# Altium schematic sheet BLDC_MOTOR_TC264.SCHDOC
size A2
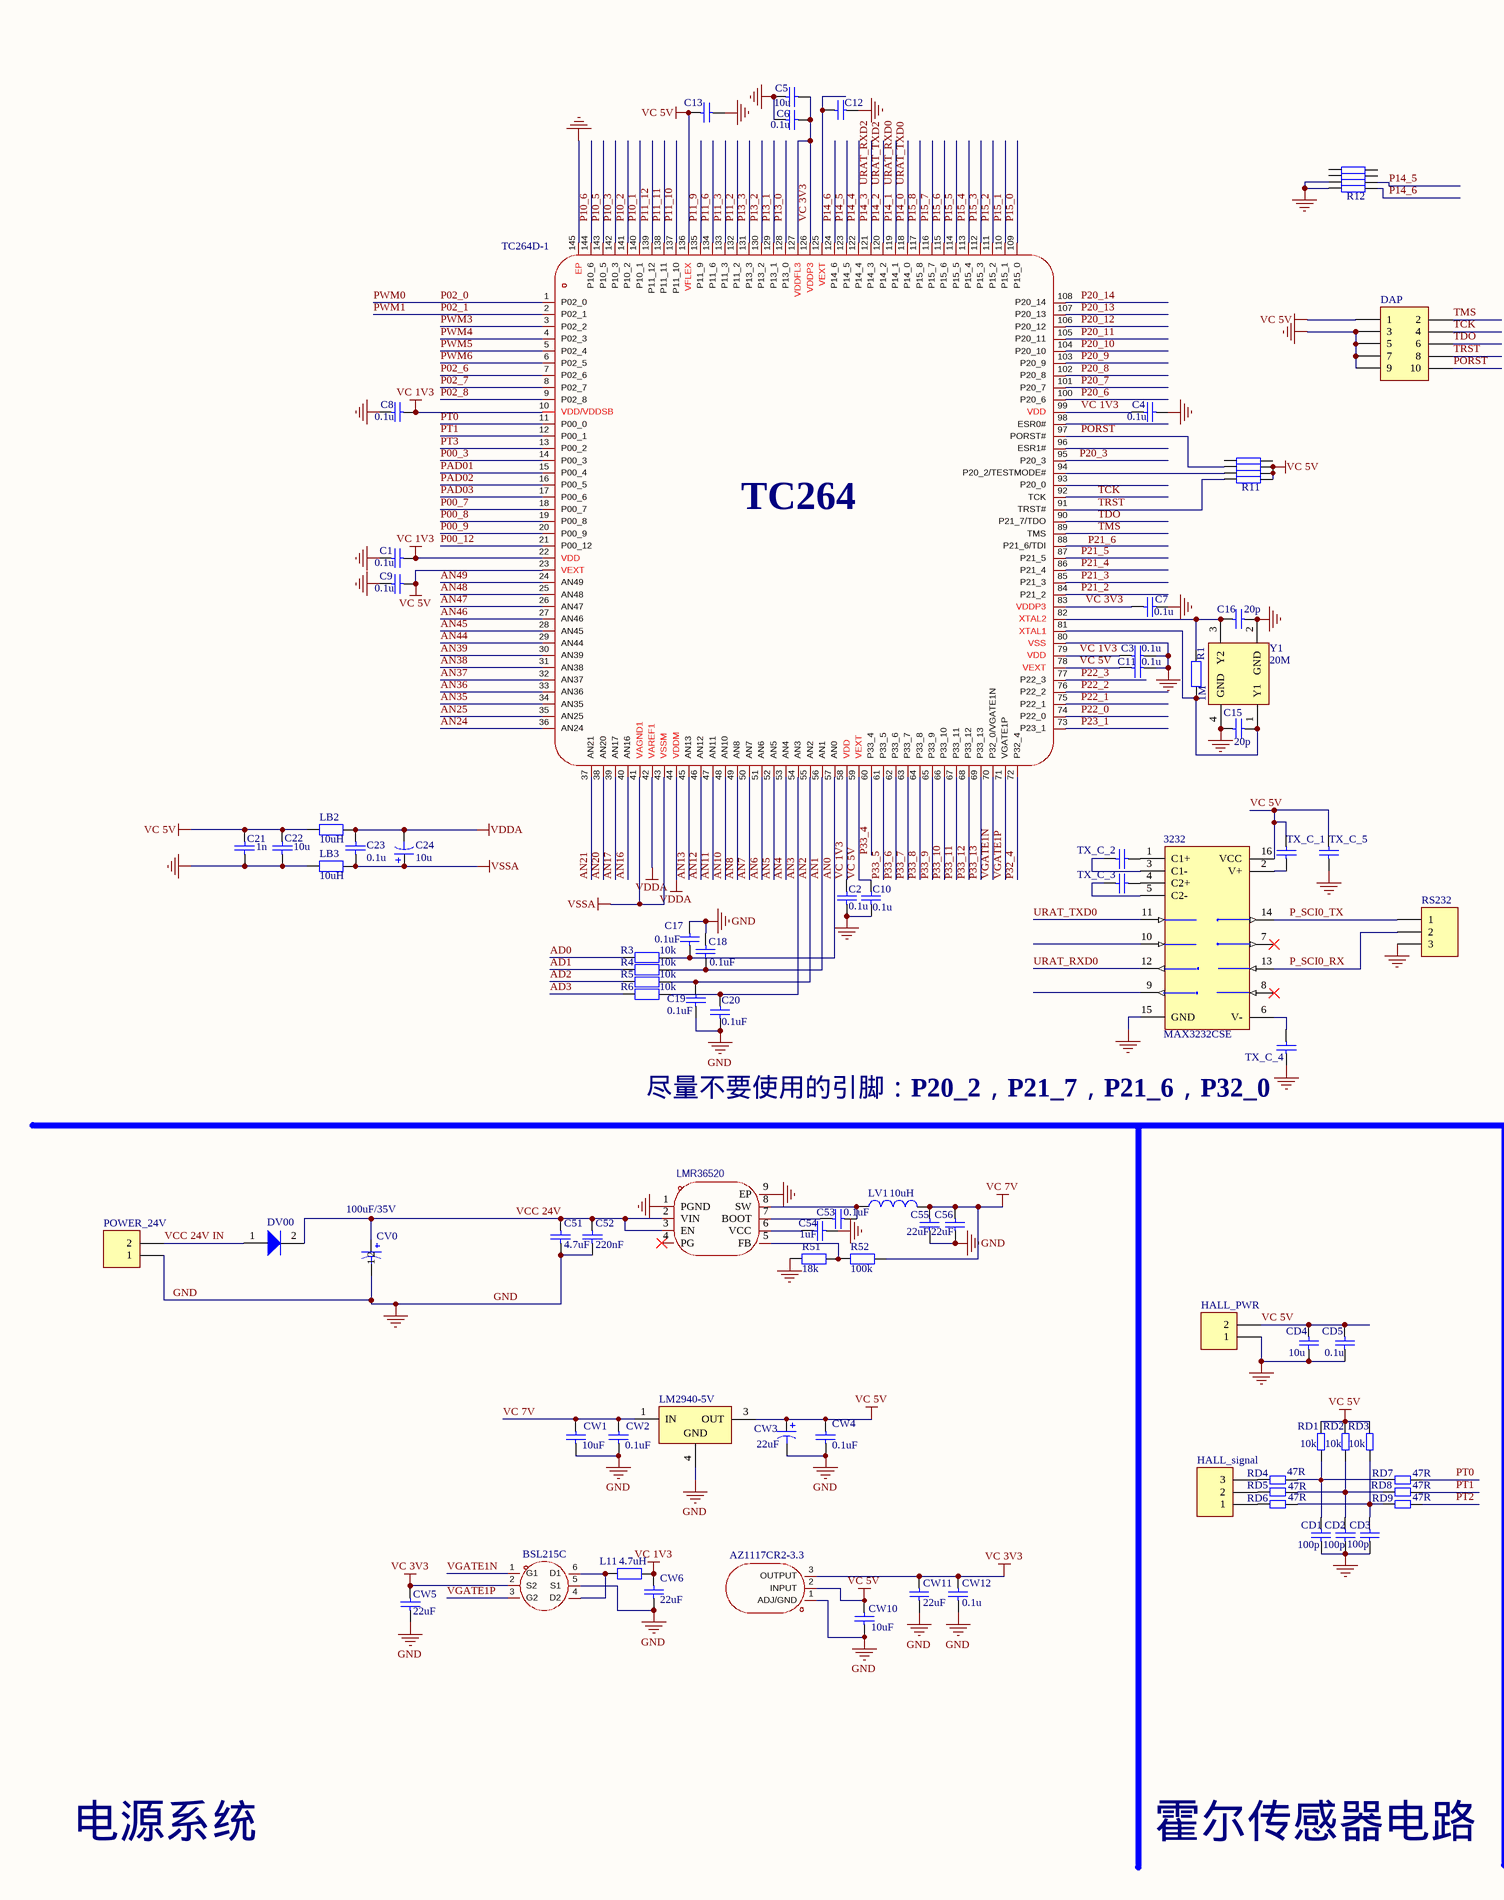
[diagram p0: BLDC_MOTOR_TC264.SCHDOC, left]
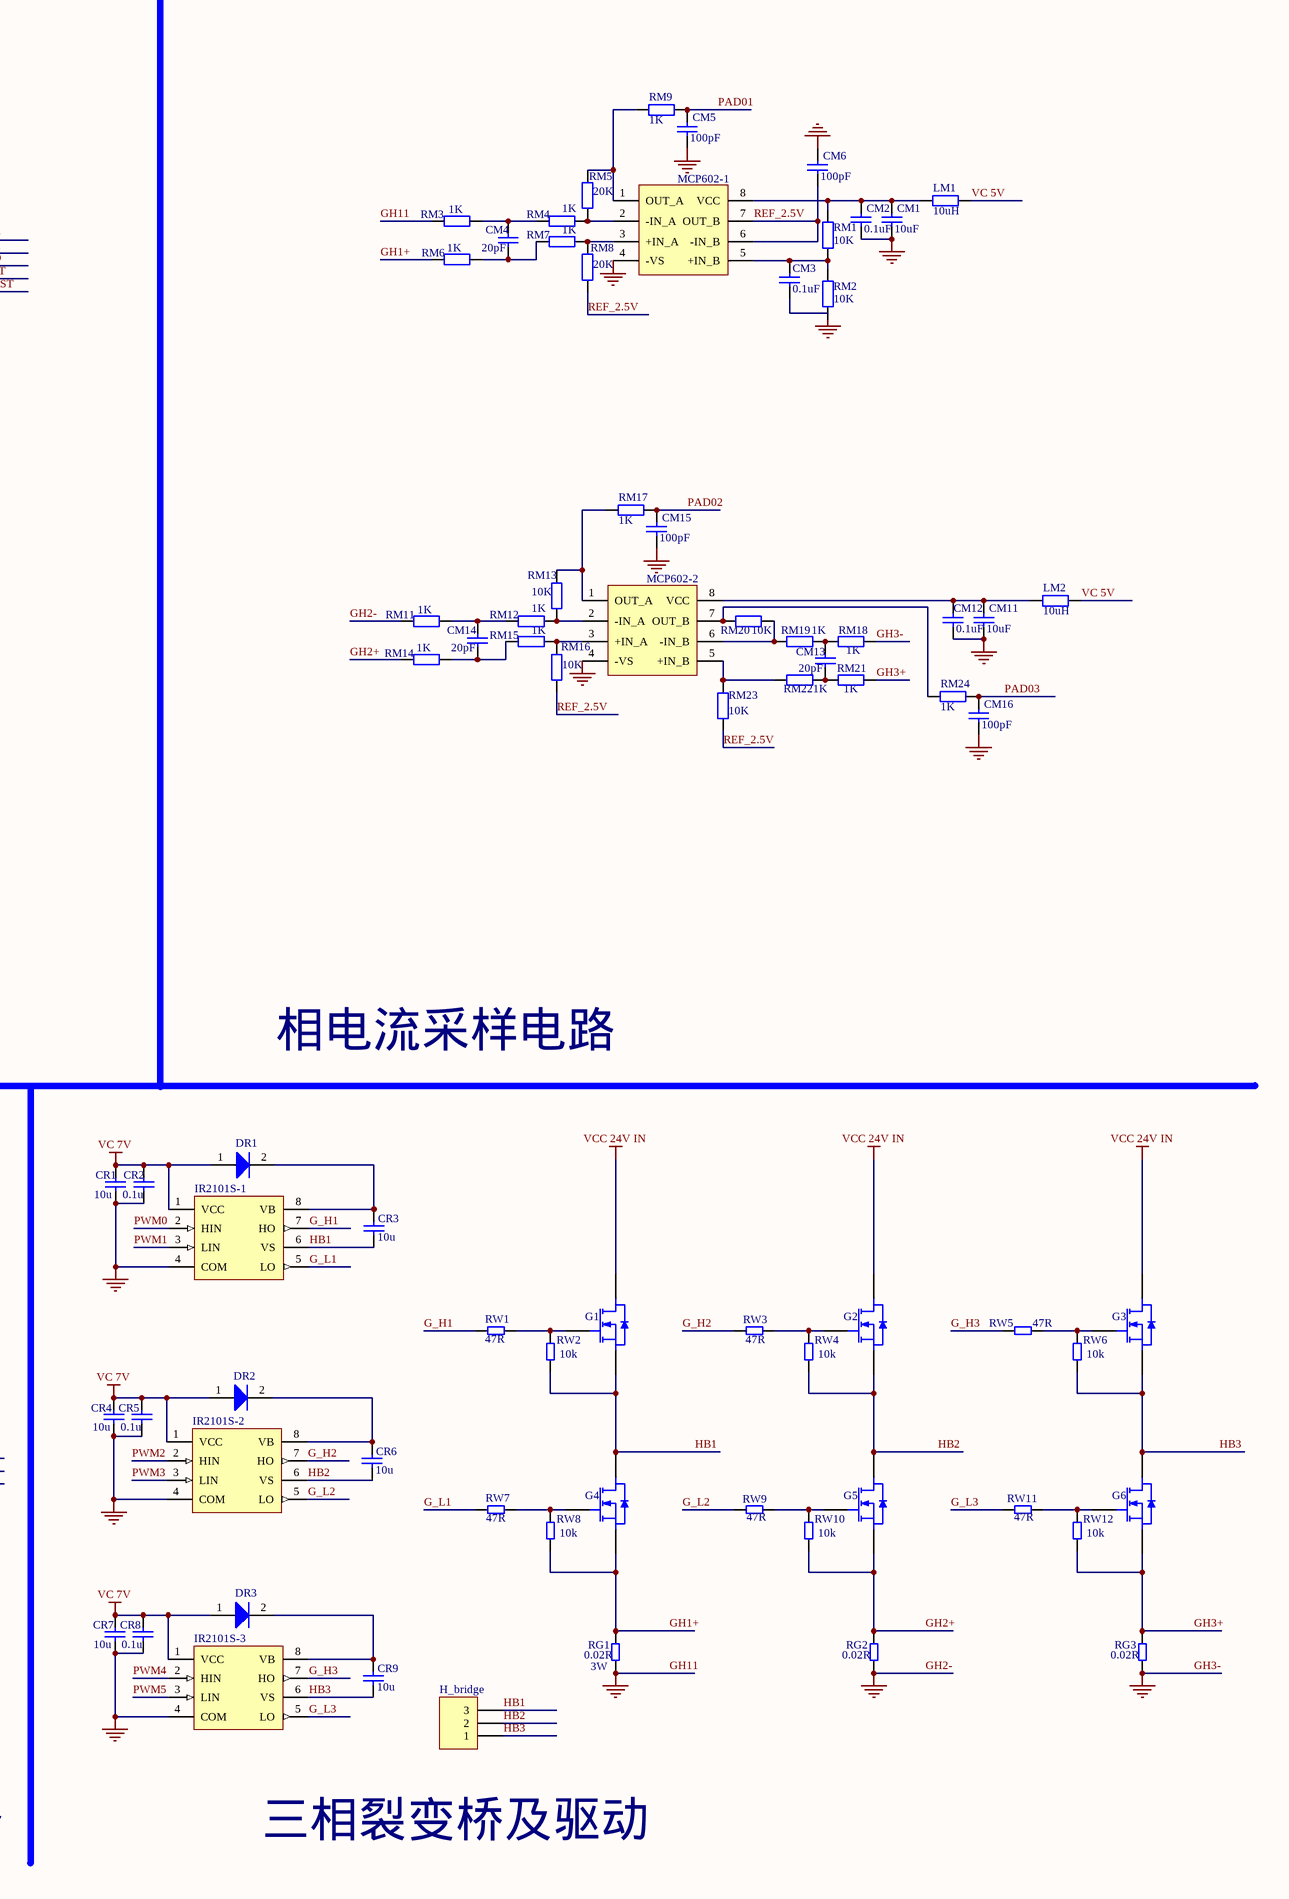
[diagram p1: BLDC_MOTOR_TC264.SCHDOC, right]

## Parts
3232  MAX3232CSE  [LC-TSSOP-16]
AZ1117CR2-3.3  AZ1117CR2-3.3  [LC-SOT-89(SOT-89-3)]
BSL215C  BSL215C  [LC-SOT-23-6]
C1  0.1u  [LC-0603_C]
C2  0.1u  [LC-0603_C]
C3  0.1u  [LC-0603_C]
C4  0.1u  [LC-0603_C]
C5  10u  [LC-0603_C]
C6  0.1u  [LC-0603_C]
C7  0.1u  [LC-0603_C]
C8  0.1u  [LC-0603_C]
C9  0.1u  [LC-0603_C]
C10  0.1u  [LC-0603_C]
C11  0.1u  [LC-0603_C]
C12  0.1u  [LC-0603_C]  (value not drawn)
C13  0.1u  [LC-0603_C]  (value not drawn)
C15  20p  [LC-0603_C]
C16  20p  [LC-0603_C]
C17  0.1uF  [LC-0603_C]
C18  0.1uF  [LC-0603_C]
C19  0.1uF  [LC-0603_C]
C20  0.1uF  [LC-0603_C]
C21  1n  [LC-0603_C]
C22  10u  [LC-0603_C]
C23  0.1u  [LC-0603_C]
C24  10u  [LC-0603_C]
C51  4.7uF  [LC-0805_C]
C52  220nF  [LC-0805_C]
C53  0.1uF  [LC-0603_C]
C54  1uF  [LC-0603_C]
C55  22uF  [LC-0805_C]
C56  22uF  [LC-0805_C]
CD1  100p  [LC-0805_C]
CD2  100p  [LC-0805_C]
CD3  100p  [LC-0805_C]
CD4  10u  [LC-0805_C]
CD5  0.1u  [LC-0805_C]
CM1  value 10uF  [LC-0805_C]  (hidden comment: 10u)
CM2  value 0.1uF  [LC-0805_C]  (hidden comment: Cap)
CM3  value 0.1uF  [0805]  (hidden comment: Cap)
CM4  value 20pF  [LC-0805_C]  (hidden comment: Cap)
CM5  value 100pF  [LC-0805_C]  (hidden comment: Cap)
CM6  value 100pF  [LC-0805_C]  (hidden comment: Cap)
CM11  value 10uF  [LC-0805_C]  (hidden comment: 10u)
CM12  value 0.1uF  [LC-0805_C]  (hidden comment: Cap)
CM13  value 20pF  [LC-0805_C]  (hidden comment: Cap)
CM14  value 20pF  [LC-0805_C]  (hidden comment: Cap)
CM15  value 100pF  [LC-0805_C]  (hidden comment: Cap)
CM16  100pF  [LC-0805_C]
CR1  10u  [LC-0805_C]
CR2  0.1u  [LC-0805_C]
CR3  10u  [LC-1206_C]
CR4  10u  [LC-0805_C]
CR5  0.1u  [LC-0805_C]
CR6  10u  [LC-1206_C]
CR7  10u  [LC-0805_C]
CR8  0.1u  [LC-0805_C]
CR9  10u  [LC-1206_C]
CV0  value 100uF/35V  [CAP_SMD_8*10.2]  (hidden comment: Cap Pol1)
CW1  10uF  [LC-0603_C]
CW2  value 0.1uF  [LC-0603_C]  (hidden comment: 0.1u)
CW3  22uF  [LC-0805_C]
CW4  value 0.1uF  [LC-0603_C]  (hidden comment: 0.1u)
CW5  22uF  [LC-0603_C]
CW6  22uF  [LC-0603_C]
CW10  10uF  [LC-0603_C]
CW11  22uF  [LC-0603_C]
CW12  0.1u  [LC-0603_C]
DAP  Header 5X2  [HDR2X5]  (value not drawn)
DR1  C84635  [LC-SMA(DO-214AC)_S2]  (value not drawn)
DR2  C84635  [LC-SMA(DO-214AC)_S2]  (value not drawn)
DR3  C84635  [LC-SMA(DO-214AC)_S2]  (value not drawn)
DV00  C35722  [LC-SMA(DO-214AC)_S5]  (value not drawn)
G1  BUK9222  [TO-252-2]  (value not drawn)
G2  BUK9222  [TO-252-2]  (value not drawn)
G3  BUK9222  [TO-252-2]  (value not drawn)
G4  BUK9222  [TO-252-2]  (value not drawn)
G5  BUK9222  [TO-252-2]  (value not drawn)
G6  BUK9222  [TO-252-2]  (value not drawn)
H_bridge  Header 3  [kf128_duanzi_3P]  (value not drawn)
HALL_PWR  (no value)  [KF128-jiexian_2P]
HALL_signal  Header 3  [kf128_duanzi_3P]  (value not drawn)
IR2101S-1  IR2101  [LC-SOIC-8_150mil]  (value not drawn)
IR2101S-2  IR2101  [LC-SOIC-8_150mil]  (value not drawn)
IR2101S-3  IR2101  [LC-SOIC-8_150mil]  (value not drawn)
L11  4.7uH  [L0806]
LB2  value 10uH  [LC-1206_L]  (hidden comment: C1051)
LB3  value 10uH  [LC-1206_L]  (hidden comment: C1051)
LM1  10uH  [LC-0805_L]
LM2  10uH  [LC-0805_L]
LM2940-5V  LM2940  [LC-SOT-223]  (value not drawn)
LMR36520  LMR36520FADDAR  [LC-SOIC-8_EP_150mil]  (value not drawn)
LV1  value 10uH  [SMD_0650]  (hidden comment: Inductor)
MCP602-1  LM258  [SOP8_555_lm393]  (value not drawn)
MCP602-2  LM258  [SOP8_555_lm393]  (value not drawn)
POWER_24V  Header 2  [KF128-jiexian_2P]  (value not drawn)
R1  1M  [LC-0603_R]
R3  10k  [LC-0603_R]
R4  10k  [LC-0603_R]
R5  10k  [LC-0603_R]
R6  10k  [LC-0603_R]
R11  10k  [LC-0603_Rx4]  (value not drawn)
R12  47k  [LC-0603_Rx4]  (value not drawn)
R51  18k  [LC-0603_R]
R52  100k  [LC-0603_R]
RD1  10k  [LC-0805_R]
RD2  10k  [LC-0805_R]
RD3  10k  [LC-0805_R]
RD4  47R  [LC-0805_R]
RD5  47R  [LC-0805_R]
RD6  47R  [LC-0805_R]
RD7  47R  [LC-0805_R]
RD8  47R  [LC-0805_R]
RD9  47R  [LC-0805_R]
RG1  0.02R  [LC-2512_R]
RG2  0.02R  [LC-2512_R]
RG3  0.02R  [LC-2512_R]
RM1  value 10K  [LC-0805_R]  (hidden comment: Res2)
RM2  value 10K  [LC-0805_R]  (hidden comment: Res2)
RM3  value 1K  [LC-0805_R]  (hidden comment: Res2)
RM4  value 1K  [LC-0805_R]  (hidden comment: Res2)
RM5  value 20K  [LC-0805_R]  (hidden comment: Res2)
RM6  value 1K  [LC-0805_R]  (hidden comment: Res2)
RM7  value 1K  [LC-0805_R]  (hidden comment: Res2)
RM8  value 20K  [LC-0805_R]  (hidden comment: Res2)
RM9  value 1K  [LC-0805_R]  (hidden comment: Res2)
RM11  value 1K  [LC-0805_R]  (hidden comment: Res2)
RM12  value 1K  [LC-0805_R]  (hidden comment: Res2)
RM13  value 10K  [LC-0805_R]  (hidden comment: Res2)
RM14  value 1K  [LC-0805_R]  (hidden comment: Res2)
RM15  value 1K  [LC-0805_R]  (hidden comment: Res2)
RM16  value 10K  [LC-0805_R]  (hidden comment: Res2)
RM17  value 1K  [LC-0805_R]  (hidden comment: Res2)
RM18  value 1K  [LC-0805_R]  (hidden comment: Res2)
RM19  value 1K  [LC-0805_R]  (hidden comment: Res2)
RM20  value 10K  [LC-0805_R]  (hidden comment: Res2)
RM21  value 1K  [LC-0805_R]  (hidden comment: Res2)
RM22  value 1K  [LC-0805_R]  (hidden comment: Res2)
RM23  value 10K  [LC-0805_R]  (hidden comment: Res2)
RM24  value 1K  [LC-0805_R]  (hidden comment: Res2)
RS232  Header 3  [kf128_duanzi_3P]  (value not drawn)
RW1  47R  [0805]
RW2  10k  [0805]
RW3  47R  [0805]
RW4  10k  [0805]
RW5  47R  [0805]
RW6  10k  [0805]
RW7  47R  [0805]
RW8  10k  [0805]
RW9  47R  [0805]
RW10  10k  [0805]
RW11  47R  [0805]
RW12  10k  [0805]
TC264D-1  TC264D  [TC264D-LQFP144]  (value not drawn)
TX_C_1  0.1u  [LC-0603_C]  (value not drawn)
TX_C_2  0.1u  [LC-0603_C]  (value not drawn)
TX_C_3  0.1u  [LC-0603_C]  (value not drawn)
TX_C_4  0.1u  [LC-0603_C]  (value not drawn)
TX_C_5  0.1u  [LC-0603_C]  (value not drawn)
Y1  20M  [LC-SMD-3225_4P]

## Nets
GH11: 3232.15(GND) AZ1117CR2-3.3.1(ADJ/GND) BSL215C.5(S1) C1.2 C2.1 C3.1 C4.1 C5.1 C6.2 C7.2 C8.2 C9.2 C10.2 C11.1 C12.1 C13.2 C15.1 C16.1 C17.2 C18.2 C19.1 C20.1 C21.2 C22.2 C51.1 C52.1 C54.1 C55.2 C56.2 CD1.2 CD2.2 CD3.2 CD4.2 CD5.2 CM1.1 CM2.1 CM3.1 CM5.1 CM6.2 CM11.1 CM12.1 CM15.1 CM16.1 CR1.2 CR2.2 CR4.2 CR5.2 CR7.2 CR8.2 CV0.2 CW1.1 CW2.1 CW3.2 CW4.1 CW5.1 CW6.1 CW10.1 CW11.1 CW12.1 DAP.3 DAP.5 DAP.7 DAP.9 HALL_PWR.1 IR2101S-1.4(COM) IR2101S-2.4(COM) IR2101S-3.4(COM) LB3.2 LM2940-5V.4(GND) LMR36520.1(PGND) LMR36520.9(EP) MCP602-1.4(-VS) MCP602-2.4(-VS) POWER_24V.1 R12.3 R12.4 R51.2 RG1.2 RG2.2 RG3.2 RM3.2 RM11.2 RM18.2 RS232.3 TC264D-1.80(VSS) TC264D-1.145(EP) TX_C_4.1 TX_C_5.1 Y1.2(GND) Y1.4(GND)  [also labelled GH2-, GH3-, GND]
VC 1V3: C1.1 C2.2 C3.2 C4.2 C8.1 CW6.2 L11.2 TC264D-1.10(VDD/VDDSB) TC264D-1.22(VDD) TC264D-1.58(VDD) TC264D-1.79(VDD) TC264D-1.99(VDD)
VC 3V3: AZ1117CR2-3.3.3(OUTPUT) BSL215C.2(S2) C5.2 C6.1 C7.1 CW5.2 CW11.2 CW12.2 TC264D-1.83(VDDP3) TC264D-1.126(VDDP3) TC264D-1.127(VDDFL3)
VC 5V: 3232.16(VCC) AZ1117CR2-3.3.2(INPUT) C9.1 C10.1 C11.2 C13.1 C21.1 C22.1 CD4.1 CD5.1 CW3.1 CW4.2 CW10.2 DAP.1 HALL_PWR.2 LB2.2 LM1.1 LM2.1 LM2940-5V.3(OUT) R11.5 R11.6 R11.7 RD1.1 RD2.1 RD3.1 TC264D-1.23(VEXT) TC264D-1.59(VEXT) TC264D-1.78(VEXT) TC264D-1.136(VFLEX) TX_C_1.2 TX_C_5.2
VC 7V: C55.1 C56.1 CR1.1 CR2.1 CR4.1 CR5.1 CR7.1 CR8.1 CW1.2 CW2.2 DR1.1(A) DR2.1(A) DR3.1(A) IR2101S-1.1(VCC) IR2101S-2.1(VCC) IR2101S-3.1(VCC) LM2940-5V.1(IN) LV1.2 R52.1
VCC 24V IN: DV00.1(A) G1.2(D) G2.2(D) G3.2(D) POWER_24V.2
VDDA: C23.1 C24.2 LB2.1 TC264D-1.42(VAREF1) TC264D-1.44(VDDM)
VSSA: C23.2 C24.1 LB3.1 TC264D-1.41(VAGND1) TC264D-1.43(VSSM)
AD0: R3.1
AD1: R4.1
AD2: R5.1
AD3: R6.1
AN0: C17.1 R3.2 TC264D-1.57(AN0)
AN1: C18.1 R4.2 TC264D-1.56(AN1)
AN2: C19.2 R5.2 TC264D-1.55(AN2)
AN3: C20.2 R6.2 TC264D-1.54(AN3)
AN4: TC264D-1.53(AN4)
AN5: TC264D-1.52(AN5)
AN6: TC264D-1.51(AN6)
AN7: TC264D-1.50(AN7)
AN8: TC264D-1.49(AN8)
AN10: TC264D-1.48(AN10)
AN11: TC264D-1.47(AN11)
AN12: TC264D-1.46(AN12)
AN13: TC264D-1.45(AN13)
AN16: TC264D-1.40(AN16)
AN17: TC264D-1.39(AN17)
AN20: TC264D-1.38(AN20)
AN21: TC264D-1.37(AN21)
AN24: TC264D-1.36(AN24)
AN25: TC264D-1.35(AN25)
AN35: TC264D-1.34(AN35)
AN36: TC264D-1.33(AN36)
AN37: TC264D-1.32(AN37)
AN38: TC264D-1.31(AN38)
AN39: TC264D-1.30(AN39)
AN44: TC264D-1.29(AN44)
AN45: TC264D-1.28(AN45)
AN46: TC264D-1.27(AN46)
AN47: TC264D-1.26(AN47)
AN48: TC264D-1.25(AN48)
AN49: TC264D-1.24(AN49)
G_H1: IR2101S-1.7(HO) RW1.2
G_H2: IR2101S-2.7(HO) RW3.2
G_H3: IR2101S-3.7(HO) RW5.2
G_L1: IR2101S-1.5(LO) RW7.2
G_L2: IR2101S-2.5(LO) RW9.2
G_L3: IR2101S-3.5(LO) RW11.2
GH1+: G4.3(S) RG1.1 RM6.2 RW8.1
GH2+: G5.3(S) RG2.1 RM14.2 RW10.1
GH3+: G6.3(S) RG3.1 RM21.2 RW12.1
HB1: CR3.2 G1.3(S) G4.2(D) H_bridge.3 IR2101S-1.6(VS) RW2.1
HB2: CR6.2 G2.3(S) G5.2(D) H_bridge.2 IR2101S-2.6(VS) RW4.1
HB3: CR9.2 G3.3(S) G6.2(D) H_bridge.1 IR2101S-3.6(VS) RW6.1
P00_3: TC264D-1.14(P00_3)
P00_7: TC264D-1.18(P00_7)
P00_8: TC264D-1.19(P00_8)
P00_9: TC264D-1.20(P00_9)
P00_12: TC264D-1.21(P00_12)
P02_0: IR2101S-1.2(HIN) TC264D-1.1(P02_0)  [also labelled PWM0]
P02_1: IR2101S-1.3(LIN) TC264D-1.2(P02_1)  [also labelled PWM1]
P02_6: TC264D-1.7(P02_6)
P02_7: TC264D-1.8(P02_7)
P02_8: TC264D-1.9(P02_8)
P10_1: TC264D-1.140(P10_1)
P10_2: TC264D-1.141(P10_2)
P10_3: TC264D-1.142(P10_3)
P10_5: TC264D-1.143(P10_5)
P10_6: TC264D-1.144(P10_6)
P11_2: TC264D-1.132(P11_2)
P11_3: TC264D-1.133(P11_3)
P11_6: TC264D-1.134(P11_6)
P11_9: TC264D-1.135(P11_9)
P11_10: TC264D-1.137(P11_10)
P11_11: TC264D-1.138(P11_11)
P11_12: TC264D-1.139(P11_12)
P13_0: TC264D-1.128(P13_0)
P13_1: TC264D-1.129(P13_1)
P13_2: TC264D-1.130(P13_2)
P13_3: TC264D-1.131(P13_3)
P14_0: 3232.11(T1IN) TC264D-1.118(P14_0)  [also labelled URAT_TXD0]
P14_1: 3232.12(R1OUT) TC264D-1.119(P14_1)  [also labelled URAT_RXD0]
P14_2: TC264D-1.120(P14_2)  [also labelled URAT_TXD2]
P14_3: TC264D-1.121(P14_3)  [also labelled URAT_RXD2]
P14_4: TC264D-1.122(P14_4)
P14_5: R12.6 TC264D-1.123(P14_5)
P14_6: R12.5 TC264D-1.124(P14_6)
P15_0: TC264D-1.109(P15_0)
P15_1: TC264D-1.110(P15_1)
P15_2: TC264D-1.111(P15_2)
P15_3: TC264D-1.112(P15_3)
P15_4: TC264D-1.113(P15_4)
P15_5: TC264D-1.114(P15_5)
P15_6: TC264D-1.115(P15_6)
P15_7: TC264D-1.116(P15_7)
P15_8: TC264D-1.117(P15_8)
P20_3: TC264D-1.95(P20_3)
P20_6: TC264D-1.100(P20_6)
P20_7: TC264D-1.101(P20_7)
P20_8: TC264D-1.102(P20_8)
P20_9: TC264D-1.103(P20_9)
P20_10: TC264D-1.104(P20_10)
P20_11: TC264D-1.105(P20_11)
P20_12: TC264D-1.106(P20_12)
P20_13: TC264D-1.107(P20_13)
P20_14: TC264D-1.108(P20_14)
P21_2: TC264D-1.84(P21_2)
P21_3: TC264D-1.85(P21_3)
P21_4: TC264D-1.86(P21_4)
P21_5: TC264D-1.87(P21_5)
P22_0: TC264D-1.74(P22_0)
P22_1: TC264D-1.75(P22_1)
P22_2: TC264D-1.76(P22_2)
P22_3: TC264D-1.77(P22_3)
P23_1: TC264D-1.73(P23_1)
P32_4: TC264D-1.72(P32_4)
P33_4: TC264D-1.60(P33_4)
P33_5: TC264D-1.61(P33_5)
P33_6: TC264D-1.62(P33_6)
P33_7: TC264D-1.63(P33_7)
P33_8: TC264D-1.64(P33_8)
P33_9: TC264D-1.65(P33_9)
P33_10: TC264D-1.66(P33_10)
P33_11: TC264D-1.67(P33_11)
P33_12: TC264D-1.68(P33_12)
P33_13: TC264D-1.69(P33_13)
P_SCI0_RX: 3232.13(R1IN) RS232.2
P_SCI0_TX: 3232.14(T1OUT) RS232.1
PAD01: CM5.2 RM9.1 TC264D-1.15(P00_4)
PAD02: CM15.2 RM17.1 TC264D-1.16(P00_5)
PAD03: CM16.2 RM24.1 TC264D-1.17(P00_6)
PORST: DAP.10 R11.2 TC264D-1.97(PORST#)
PT0: RD7.1 TC264D-1.11(P00_0)
PT1: RD8.1 TC264D-1.12(P00_1)
PT2: RD9.1
PT3: TC264D-1.13(P00_2)
PWM2: IR2101S-2.2(HIN)
PWM3: IR2101S-2.3(LIN) TC264D-1.3(P02_2)
PWM4: IR2101S-3.2(HIN) TC264D-1.4(P02_3)
PWM5: IR2101S-3.3(LIN) TC264D-1.5(P02_4)
PWM6: TC264D-1.6(P02_5)
REF_2.5V: CM6.1 MCP602-1.6(-IN_B) MCP602-1.7(OUT_B) RM8.1 RM16.1 RM23.2
TCK: DAP.4 TC264D-1.92(TCK)
TDO: DAP.6 TC264D-1.90(P21_7/TDO)
TMS: DAP.2 TC264D-1.89(TMS)
TRST: DAP.8 R11.4 TC264D-1.91(TRST#)
VCC 24V: C51.2 C52.2 CV0.1 DV00.2(K) LMR36520.2(VIN) LMR36520.3(EN)
VGATE1N: BSL215C.1(G1) TC264D-1.70(P32_0/VGATE1N)
VGATE1P: BSL215C.3(G2) TC264D-1.71(VGATE1P)
Net3232_1: 3232.1(C1+) TX_C_2.2
Net3232_2: 3232.2(V+) TX_C_1.1
Net3232_3: 3232.3(C1-) TX_C_2.1
Net3232_4: 3232.4(C2+) TX_C_3.2
Net3232_5: 3232.5(C2-) TX_C_3.1
Net3232_6: 3232.6(V-) TX_C_4.2
NetBSL215C_4: BSL215C.4(D2) BSL215C.6(D1) L11.1
NetC12_2: C12.2 TC264D-1.125(VEXT)
NetC15_2: C15.2 R1.1 TC264D-1.81(XTAL1) Y1.1(Y1)
NetC16_2: C16.2 R1.2 TC264D-1.82(XTAL2) Y1.3(Y2)
NetC53_1: C53.1 LMR36520.8(SW) LV1.1
NetC53_2: C53.2 LMR36520.7(BOOT)
NetC54_2: C54.2 LMR36520.6(VCC)
NetCD1_1: CD1.1 RD1.2 RD4.1 RD7.2
NetCD2_1: CD2.1 RD2.2 RD5.1 RD8.2
NetCD3_1: CD3.1 RD3.2 RD6.1 RD9.2
NetCM1_2: CM1.2 CM2.2 LM1.2 MCP602-1.8(VCC) RM1.2
NetCM3_2: CM3.2 MCP602-1.5(+IN_B) RM1.1 RM2.2
NetCM4_1: CM4.1 RM6.1 RM7.2
NetCM4_2: CM4.2 RM3.1 RM4.2
NetCM11_2: CM11.2 CM12.2 LM2.2 MCP602-2.8(VCC)
NetCM13_1: CM13.1 RM18.1 RM19.2
NetCM13_2: CM13.2 RM21.1 RM22.2
NetCM14_1: CM14.1 RM14.1 RM15.2
NetCM14_2: CM14.2 RM11.1 RM12.2
NetCR3_1: CR3.1 DR1.2(K) IR2101S-1.8(VB)
NetCR6_1: CR6.1 DR2.2(K) IR2101S-2.8(VB)
NetCR9_1: CR9.1 DR3.2(K) IR2101S-3.8(VB)
NetG1_1: G1.1(G) RW1.1 RW2.2
NetG2_1: G2.1(G) RW3.1 RW4.2
NetG3_1: G3.1(G) RW5.1 RW6.2
NetG4_1: G4.1(G) RW7.1 RW8.2
NetG5_1: G5.1(G) RW9.1 RW10.2
NetG6_1: G6.1(G) RW11.1 RW12.2
NetHALL_signal_1: HALL_signal.1 RD6.2
NetHALL_signal_2: HALL_signal.2 RD5.2
NetHALL_signal_3: HALL_signal.3 RD4.2
NetLMR36520_5: LMR36520.5(FB) R51.1 R52.2
NetMCP602-1_1: MCP602-1.1(OUT_A) RM5.1 RM9.2
NetMCP602-1_2: MCP602-1.2(-IN_A) RM4.1 RM5.2
NetMCP602-1_3: MCP602-1.3(+IN_A) RM7.1 RM8.2
NetMCP602-2_1: MCP602-2.1(OUT_A) RM13.1 RM17.2
NetMCP602-2_2: MCP602-2.2(-IN_A) RM12.1 RM13.2
NetMCP602-2_3: MCP602-2.3(+IN_A) RM15.1 RM16.2
NetMCP602-2_5: MCP602-2.5(+IN_B) RM22.1 RM23.1
NetMCP602-2_6: MCP602-2.6(-IN_B) RM19.1 RM20.1
NetMCP602-2_7: MCP602-2.7(OUT_B) RM20.2 RM24.2
NetR11_3: R11.3 TC264D-1.94(P20_2/TESTMODE#)

Not connected (* = marked no-connect by the designer): 3232 7(T2OUT)* 8(R2IN)* 9(R2OUT) 10(T2IN); LMR36520 4(PG)*; R11 1 8; R12 1 2 7 8; RM2 1; TC264D-1 88(P21_6/TDI) 93(P20_0) 96(ESR1#) 98(ESR0#)

## Notes on the sheet
- 尽量不要使用的引脚：P20_2，P21_7，P21_6，P32_0
- 相电流采样电路
- (near RG1) 3W
- 电源系统
- 霍尔传感器电路
- 三相裂变桥及驱动
- Labels drawn without touching a wire or pin: P21_6
- (in symbol TC264D) TC264

## Library data of the parts
3232 = MAX3232CSE: 3.0V TO 5.5V, Low-Power, up to 1Mbps, True RS-232 Transceiver Using Four 0.1礔 External Capacitor; Published: 16-Jan-2001; LatestRevisionDate: 17-Jul-2002; LatestRevisionNote: Re-released for DXP Platform.; DatasheetDocument: Mar-1999; PackageReference: NSO16; Publisher: Altium Limited; Code_JEDEC: MS-012-AC; Code_IPC: SO16
AZ1117CR2-3.3 = AZ1117CR2-3.3TRG1: Symbol: AZ1117CR2-3.3TRG1
C1-C13 C15-C23 C51-C56 CD1-CD5 CM1-CM6 CM11-CM16 CR2 CR5 CR8 CW1 CW2 CW4-CW6 CW10-CW12 TX_C_1-TX_C_5 = Cap: Capacitor; Published: 8-Jun-2000; LatestRevisionDate: 17-Jul-2002; LatestRevisionNote: Re-released for DXP Platform.; Publisher: Altium Limited
  C1-C4 C6-C13 C23: PackageReference: RAD-0.3; PackageDescription: Radial Cap, Thru-Hole; 2 Leads; 0.3 in Pin Spacing; Value: 0.1u
  C5: PackageReference: RAD-0.3; PackageDescription: Radial Cap, Thru-Hole; 2 Leads; 0.3 in Pin Spacing; Value: 10u
  C15 C16: PackageReference: RAD-0.3; PackageDescription: Radial Cap, Thru-Hole; 2 Leads; 0.3 in Pin Spacing; Value: 20p
  C17-C20: PackageReference: RAD-0.3; PackageDescription: Radial Cap, Thru-Hole; 2 Leads; 0.3 in Pin Spacing; Value: 0.1uF
  C21: Value: 1n
  C22 CD4: Value: 10u
  C51: Value: 4.7uF
  C52: Value: 220nF
  C53: Value: 0.1uF
  C54: Value: 1uF
  C55 C56 CW5 CW6 CW11: Value: 22uF
  CD1-CD3: Value: 100p
  CD5 CR2 CR5 CR8 CW12 TX_C_1-TX_C_5: Value: 0.1u
  CM16: Value: 100pF
  CW1 CW10: Value: 10uF
C24 CV0 CW3 = Cap Pol1: Polarized Capacitor (Radial); Published: 8-Jun-2000; LatestRevisionDate: 17-Jul-2002; LatestRevisionNote: Re-released for DXP Platform.; Publisher: Altium Limited
  C24: Value: 10u
  CV0: PackageReference: RB7.6-15
  CW3: Value: 22uF
CR1 CR3 CR4 CR6 CR7 CR9 = Cap: Capacitor; Value: 0.01uF; Published: 8-Jun-2000; LatestRevisionDate: 17-Jul-2002; LatestRevisionNote: Re-released for DXP Platform.; Publisher: Altium Limited
DAP = Header 5X2: Header, 5-Pin, Dual row; LatestRevisionDate: 17-Jul-2002; LatestRevisionNote: Re-released for DXP Platform.; Publisher: Altium Limited
DR1-DR3 DV00 = Diode: Default Diode; Published: 8-Jun-2000; LatestRevisionDate: 17-Jul-2002; LatestRevisionNote: Re-released for DXP Platform.; PackageDocument: Sep-1996; PackageReference: SMC; Publisher: Altium Limited; Code_JEDEC: DO-214-AB
G1-G6 = MOSFET_N
H_bridge HALL_signal RS232 = Header 3: Header, 3-Pin; LatestRevisionDate: 17-Jul-2002; LatestRevisionNote: Re-released for DXP Platform.; Publisher: Altium Limited
HALL_PWR POWER_24V = Header 2: Header, 2-Pin; LatestRevisionDate: 17-Jul-2002; LatestRevisionNote: Re-released for DXP Platform.; Publisher: Altium Limited
L11 LB2 LB3 LM1 LM2 R1 R3-R6 R52 RM1-RM9 RM11-RM24 = Res2: Resistor; Published: 8-Jun-2000; LatestRevisionDate: 17-Jul-2002; LatestRevisionNote: Re-released for DXP Platform.; Publisher: Altium Limited
  L11: Value: 4.7uH
  LM1 LM2: Value: 10uH
  R1: PackageReference: AXIAL-0.4; PackageDescription: Axial Device, Thru-Hole; 2 Leads; 0.4 in Pin Spacing; Value: 1M
  R3-R6: PackageReference: AXIAL-0.4; PackageDescription: Axial Device, Thru-Hole; 2 Leads; 0.4 in Pin Spacing; Value: 10k
  R52: Value: 100K
LM2940-5V = L7805ABD2T: Precision 1A Regulator; pin to pad: 4>2; Published: 24-Aug-2001; LatestRevisionDate: 17-Jul-2002; LatestRevisionNote: Re-released for DXP Platform.; DatasheetDocument: Nov-1999; PackageReference: TO-263; Publisher: Altium Limited
LMR36520 = LMR36520FADDAR: pin to pad: 9>0; Manufacturer: TI(德州仪器); Add into BOM: yes; Function: 降压型; Output Type: 可调; Input Voltage: 4.2V~65V; Output Voltage: 1V~28V; Output Current (Max): 2A; Switching Frequency: 400kHz; Synchronous Rectification: 是; Number of Outputs: 1; Topology: 降压式; Switch tube (built-in/external): 内置; Symbol: LMR36520FADDAR; Device: LMR36520FADDAR; LCSC Part Name: LMR36520FADDAR; Supplier Part: C1858395; Manufacturer Part: LMR36520FADDAR; Supplier Footprint: SO-8; JLCPCB Part Class: Extended Part; Datasheet: https://www.ti.com/cn/lit/gpn/lmr36520; Supplier: LCSC; Convert to PCB: yes; Operating Temperature: -40℃~+125℃@(TJ)
LV1 = Inductor: Code_IEC: 1005; Published: 8-Jun-2000; LatestRevisionDate: 17-Jul-2002; LatestRevisionNote: Re-released for DXP Platform.; PackageReference: 0402-A; Publisher: Altium Limited; Code_JEITA: 0402
R11 R12 = RES_RANGE_4
R51 = Res2: Resistor; Value: 16.9; Published: 8-Jun-2000; LatestRevisionDate: 17-Jul-2002; LatestRevisionNote: Re-released for DXP Platform.; Publisher: Altium Limited
RD1-RD9 RG1-RG3 RW1-RW12 = RES_COMMOM
Y1 = XTL-YXL
BSL215C = BSL215C: Symbol: BSL215C